# EAGLE design STM32L441CE_4L-connector_1mm_pitch (EAGLE 9.6.2)

## Sheet 1 of 2
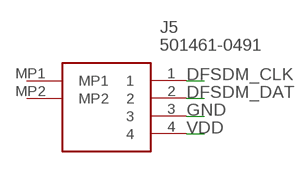
[diagram p0: schematic, sheet 1]

### Parts
J5  501461-0491  [5014610491]

### Nets
DFSDM_CLK: J5.1 ; also sheet 2
DFSDM_DAT: J5.2 ; also sheet 2
GND: J5.3 ; also sheet 2
VDD: J5.4 ; also sheet 2
Unconnected: J5.MP1 J5.MP2

## Sheet 2 of 2
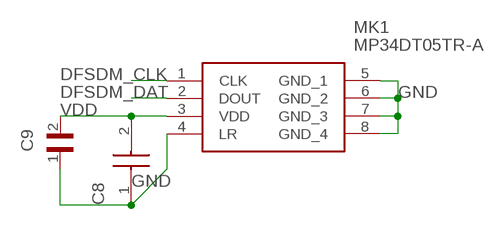
[diagram p1: schematic, sheet 2]

### Parts
C8  AMK063AC6105KP-F  [CAPC0603X33N]
C9  GRM033C80J104KE15D  [CAPC0603X33N]
MK1  MP34DT05TR-A  [MP34DT05TRA]

### Nets
DFSDM_CLK: MK1.1(CLK) ; also sheet 1
DFSDM_DAT: MK1.2(DOUT) ; also sheet 1
GND: C8.1 C9.1 MK1.4(LR) MK1.5(GND_1) MK1.6(GND_2) MK1.7(GND_3) MK1.8(GND_4) ; also sheet 1
VDD: C8.2 C9.2 MK1.3(VDD) ; also sheet 1

## Library data of the parts
C8 = AMK063AC6105KP-F:AMK063AC6105KP-F: Multilayer Ceramic Capacitors MLCC - SMD/SMT 0201 4VDC 1uF 10% X6S Source: Datasheet <https://ds.yuden.co.jp/TYCOMPAS/ut/download?pn=LMK063BBJ474MPLF&fileType=CA>; DESCRIPTION: Multilayer Ceramic Capacitors MLCC - SMD/SMT 0201 4VDC 1uF 10% X6S; HEIGHT: 0.33mm; MANUFACTURER_NAME: TAIYO YUDEN; MANUFACTURER_PART_NUMBER: AMK063AC6105KP-F; MOUSER_PART_NUMBER: 963-AMK063AC6105KP-F; MOUSER_PRICE-STOCK: https://www.mouser.com/Search/Refine.aspx?Keyword=963-AMK063AC6105KP-F
C9 = GRM033C80J104KE15D:GRM033C80J104KE15D: .1UF 6.3V 10% 0201; DESCRIPTION: SMD Capacitor X6S(EIA) with Capacitance: 0.10uF Tol. 10%. Rated Voltage: 6.3Vdc; DIGI-KEY_PART_NUMBER: 490-10390-1-ND; DIGIKEY-PURCHASE-URL: https://snapeda.com/shop?store=DigiKey&id=1836969; MF: Murata Electronics; MP: GRM033C80J104KE15D; PACKAGE: 0603 Taiyo Yuden
J5 = 501461-0491:501461-0491: MOLEX - 501461-0491 - CONNECTOR, FPC, 4POS, 1ROW, 0.5MM Source: Datasheet <https://componentsearchengine.com/Datasheets/1/501461-0491.pdf>; DESCRIPTION: MOLEX - 501461-0491 - CONNECTOR, FPC, 4POS, 1ROW, 0.5MM; HEIGHT: 3.45mm; MANUFACTURER_NAME: Molex; MANUFACTURER_PART_NUMBER: 501461-0491; MOUSER_PART_NUMBER: 538-501461-0491; MOUSER_PRICE-STOCK: https://www.mouser.co.uk/ProductDetail/Molex/501461-0491?qs=un1JgU%2F7%252BkQooiwKJB4FIA%3D%3D
MK1 = MP34DT05TR-A:MP34DT05TR-A: STMICROELECTRONICS - MP34DT05TR-A - MEMS MICROPHONE, 3.6V, HCLGA-4 Source: Datasheet <http://www.st.com/content/ccc/resource/technical/document/datasheet/group3/c7/90/d3/f6/b7/e7/40/c8/DM00415595/files/DM00415595.pdf/jcr:content/translations/en.DM00415595.pdf>; DESCRIPTION: STMICROELECTRONICS - MP34DT05TR-A - MEMS MICROPHONE, 3.6V, HCLGA-4; HEIGHT: 1mm; MANUFACTURER_NAME: STMicroelectronics; MANUFACTURER_PART_NUMBER: MP34DT05TR-A; MOUSER_PART_NUMBER: 511-MP34DT05TR-A; MOUSER_PRICE-STOCK: https://www.mouser.com/Search/Refine.aspx?Keyword=511-MP34DT05TR-A

## Board
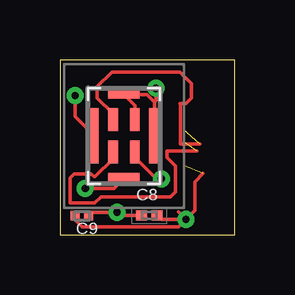
[diagram p2: board, top side]
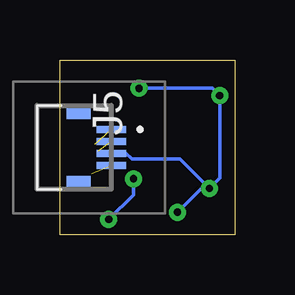
[diagram p3: board, bottom side, seen from below]

Size 7.3 x 7.3 mm. Coordinates in mm from the lower left corner, seen from the top.
Outline: 0,0 7.3,0 7.3,2.43 7.3,2.83 7.3,7.3 0,7.3 0,0
Copper layers ([2:[15:1+2*15+16]]): Top 0.035mm / dielectric 1.5mm / GND 0.035mm / dielectric 0.15mm / VDD 0.035mm / dielectric 0.2mm / Bottom 0.035mm
Design rules "default *": minimum track width 6mil, minimum drill 0.3mm, track to track 6mil, track to pad 6mil, pad to pad 6mil, via to via 6mil, smd to smd 6mil, copper to edge 10mil, drill to drill 0.3mm, minimum pad ring 10mil, minimum via ring 8mil, stop-mask expansion 4mil, vias tented up to drill 0mil, thermal gap 10mil

### Footprints (pad centres in the part's own frame; a part is rotated, then mirrored left to right if it is on the bottom)
CAPC0603X33N = smd 0.46 x 0.42: 1 -0.33,0; 2 0.33,0
CAPC0603X33N' = smd 0.38 x 0.4: 1 -0.281,0; 2 0.281,0
5014610491 = smd 0.3 x 1.21: 1 -0.75,0.925; 2 -0.25,0.925; 3 0.25,0.925; 4 0.75,0.925 | smd 0.52 x 1: MP1 -1.45,-0.43; MP2 1.45,-0.43
MP34DT05TRA = smd 0.4 x 0.95: 1 -0.45,0.675; 2 -0.45,-0.675; 3 0.45,-0.675; 4 0.45,0.675 | smd 0.35 x 2.3: 5 -1.225,0; 6 1.225,0 | smd 1.3 x 0.35: 7 0,1.725; 8 0,-1.725

### Placement (x,y rotation side)
C8  3.73,0.81 0 top
C9  GRM033C80J104KE15D  [CAPC0603X33N']  0.92,0.8 180 top
J5  6.08,3.65 270 bottom
MK1  2.67,4.13 0 top

### Tracks (layer width: path | path; a pad name or v marks a point on that pad's centre or on a via)
DFSDM_CLK  (1 unrouted)
  Top 0.152: MK1.1 2.22,5.05 1.56,5.71 1.56,6.18 2.18,6.8 5.01,6.8 5.49,6.31 5.49,5.71 5.25,5.47 5.02,5.47 5.03,5.46 5.03,3.79 5.84,3.79
DFSDM_DAT  (1 unrouted)
  Top 0.152: 5.71,3.49 4.47,3.49 4.47,3.22 4.82,2.87 4.82,1.79 4.61,1.58 1.71,1.58 1.45,1.32 0.43,1.32 0.43,2.38 0.59,2.54 1.31,2.54 1.43,2.43 1.47,2.43 2.22,3.17 MK1.2
GND  (via drill 0.3)
  Top 0.152: 3.94,5.17 3.9,5.21 MK1.6 3.95,4.18 3.95,5.54 | 3.95,5.54 3.64,5.86 MK1.7 3.13,5.39 3.13,4.82 MK1.4 | 3.95,5.54 4,5.6 v4,6.12 | v0.63,5.81 0.63,4.94 MK1.5 | MK1.8 2.67,2.35 2.26,1.94 v1.06,1.94 | C9.1 1.34,0.94 v2.39,0.94 2.52,0.81 C8.1
  Bottom 0.152: v4,6.12 0.94,6.12 v0.63,5.81 0.63,2.37 v1.06,1.94 | v2.39,0.94 1.4,1.94 v1.06,1.94 | v1.06,1.94 2.28,3.16 4.3,3.16 4.56,3.42 4.59,3.4 J5.3
VDD  (via drill 0.3)  (1 unrouted)
  Top 0.152: MK1.3 3.12,3.26 4.04,2.34 v4.23,2.34 | 4.94,0.96 v5.26,0.64 | C9.2 0.64,0.63 0.94,0.33 4.95,0.33 v5.26,0.64 | v5.26,0.64 5.63,1.01 5.63,2.21 5.97,2.55 | v5.26,0.64 4.23,0.64 C8.2
  Bottom 0.152: v5.26,0.64 4.23,1.67 v4.23,2.34